# Altium schematic sheet temperature.SchDoc
size A3; Organization: Altium Limited; Address1: L3, 12a Rodborough Rd; Address2: Frenchs Forest; Address3: NSW; Address4: Australia 2086
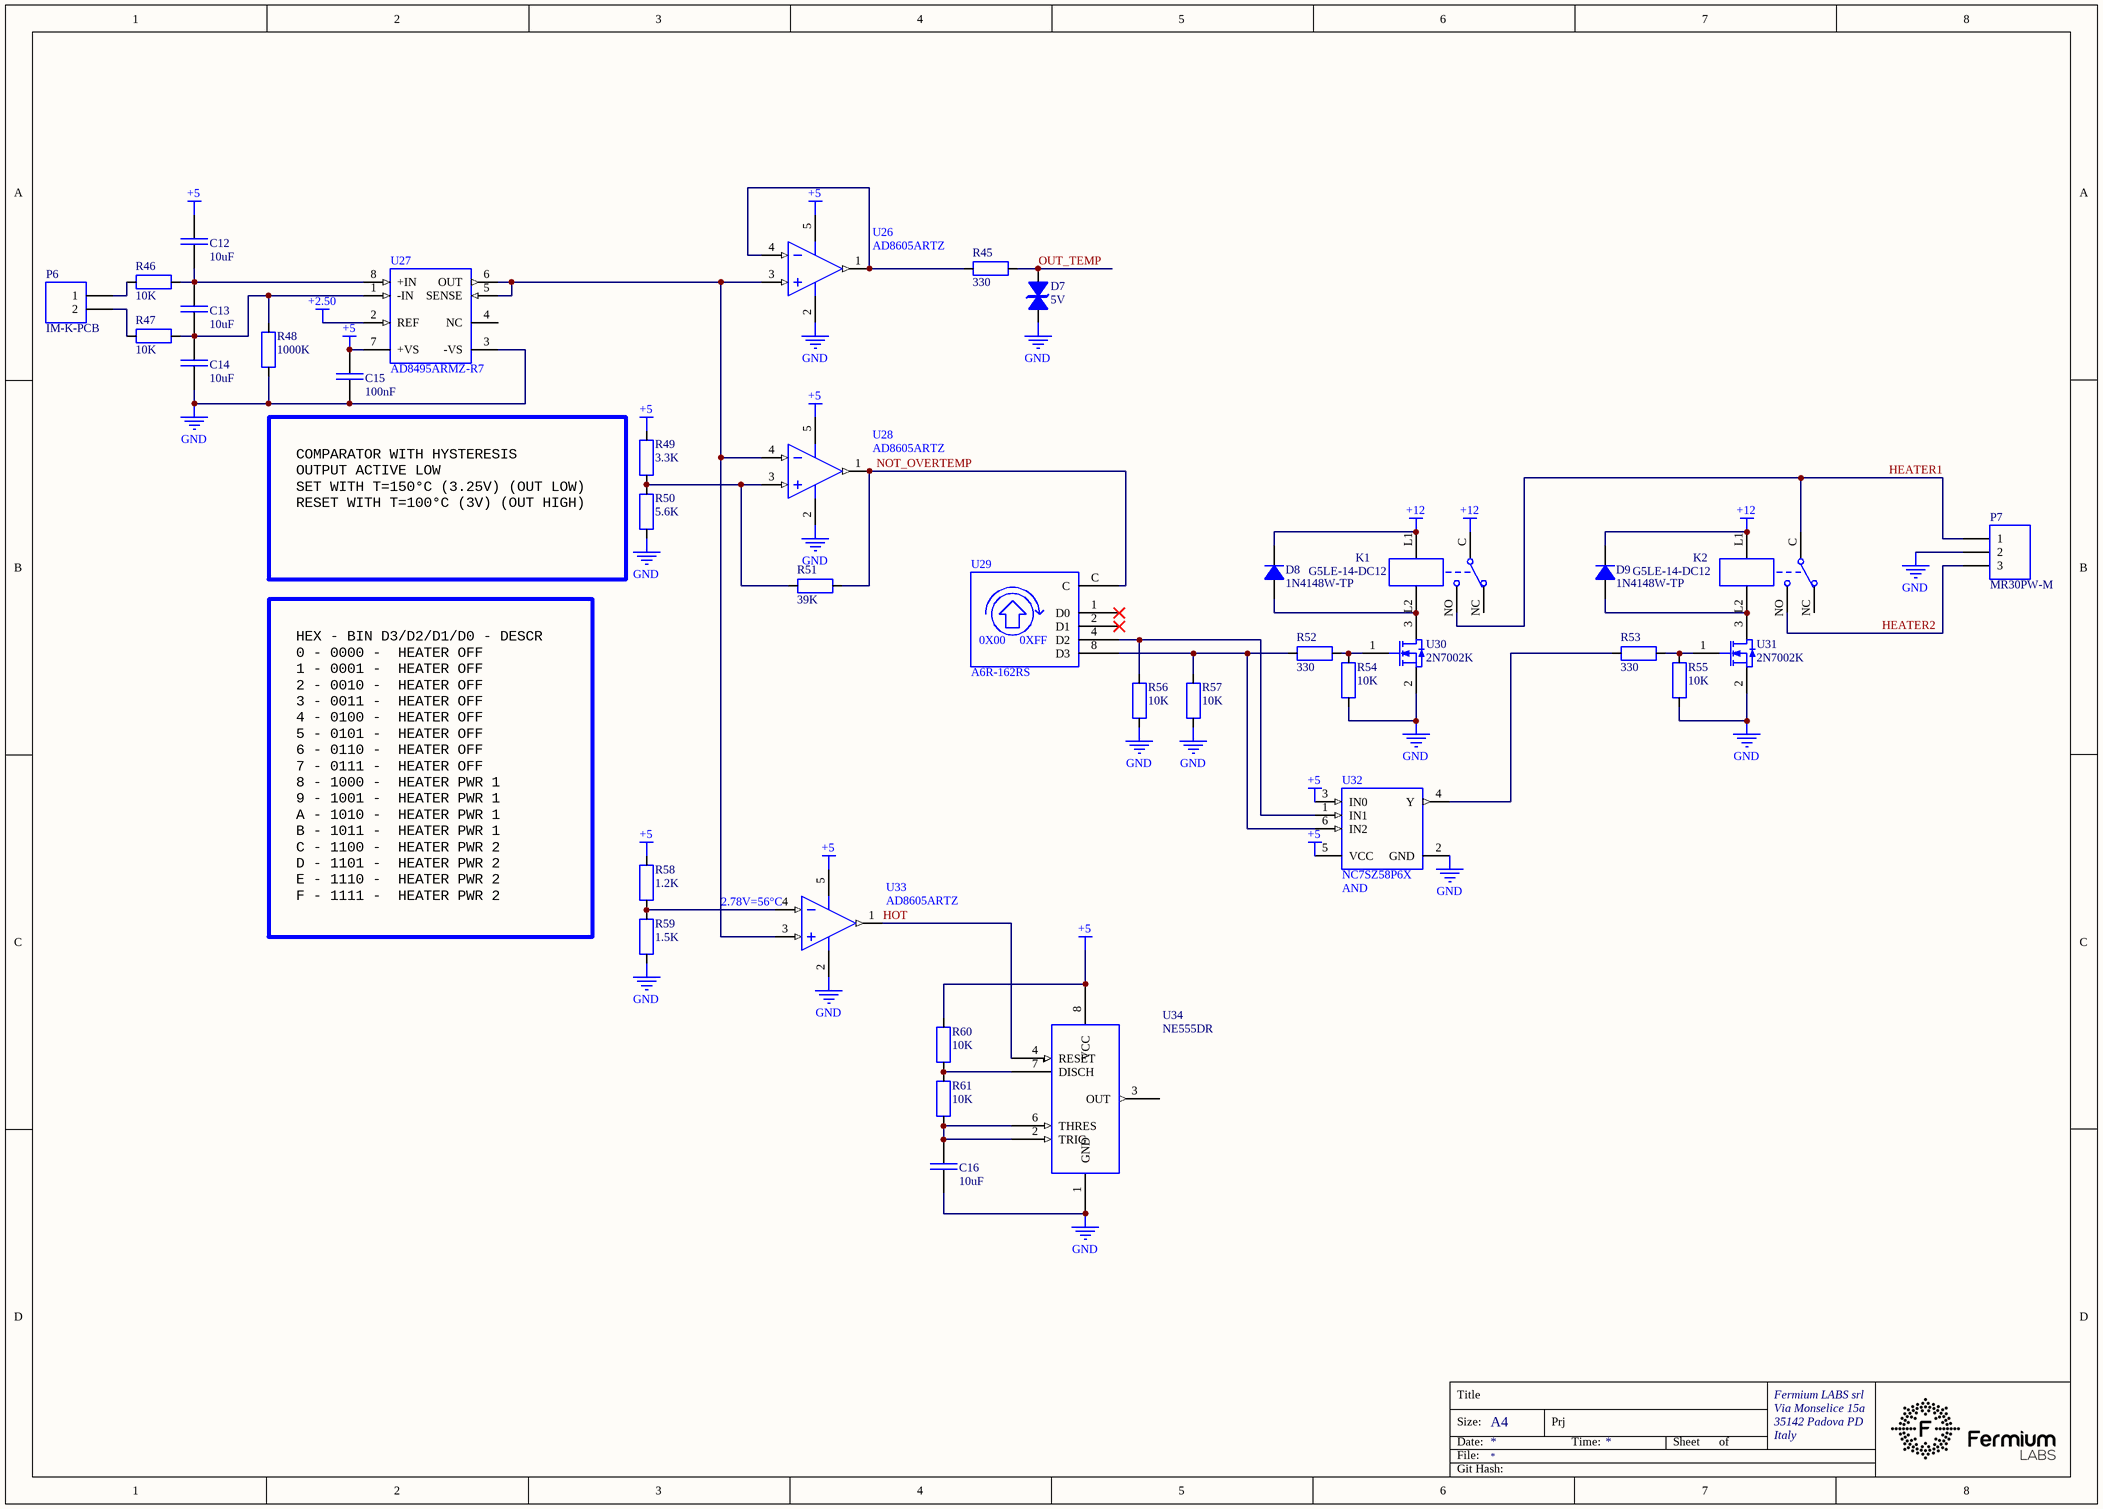
[diagram p0: temperature.SchDoc]

## Parts
C12  10uF  [CAP 0805_2012]
C13  10uF  [CAP 0805_2012]
C14  10uF  [CAP 0805_2012]
C15  100nF  [CAP 0603_1608]
C16  10uF  [CAP 0805_2012]
D7  5V  [SOD523F]
D8  1N4148W-TP  [SOD-123]
D9  1N4148W-TP  [SOD-123]
K1  G5LE-14-DC12  [AAE46D0F-8D2F-4914-8614-C04E242B4758]
K2  G5LE-14-DC12  [AAE46D0F-8D2F-4914-8614-C04E242B4758]
P6  IM-K-PCB  [9044FB30-693E-4780-9B0B-95C5421D70E8]
P7  MR30PW-M  [B3F23392-877C-4EEC-B1AF-B260E8D92153]
R45  330
R46  10K  [RES 0603_1608]
R47  10K  [RES 0603_1608]
R48  1000K
R49  3.3K
R50  5.6K
R51  39K
R52  330
R53  330
R54  10K  [RES 0603_1608]
R55  10K  [RES 0603_1608]
R56  10K  [RES 0603_1608]
R57  10K  [RES 0603_1608]
R58  1.2K
R59  1.5K
R60  10K  [RES 0603_1608]
R61  10K  [RES 0603_1608]
U26  AD8605ARTZ  [A3DDA0BC-073E-4B18-9613-F713A7EC1E27]
U27  AD8495ARMZ-R7  [ANALOG MSOP-8 RM-8]
U28  AD8605ARTZ  [A3DDA0BC-073E-4B18-9613-F713A7EC1E27]
U29  A6R-162RS  [2599C238-5645-4A8C-8BF9-C7515FACCFA0]
U30  2N7002K  [ON SEMI SOT-23-3]
U31  2N7002K  [ON SEMI SOT-23-3]
U32  NC7SZ58P6X  [CF792C6F-51F3-4C59-9918-AD84EFC14FA6]
U33  AD8605ARTZ  [A3DDA0BC-073E-4B18-9613-F713A7EC1E27]
U34  NE555DR  [TI SOIC-8 D]

## Nets
+2.50: U27.2(REF)
+5: C12.2 C15.1 R49.2 R58.2 R60.2 U26.5(+V) U27.7(+VS) U28.5(+V) U32.3(IN0) U32.5(VCC) U33.5(+V) U34.8(VCC)
+12: D8.1(K) D9.1(K) K1.C K1.L1 K2.L1
GND: C14.1 C15.2 C16.1 D7.2 P7.2 R48.1 R50.1 R54.1 R55.1 R56.1 R57.1 R59.1 U26.2(-V) U27.3(-VS) U28.2(-V) U30.2(S) U31.2(S) U32.2(GND) U33.2(-V) U34.1(GND)
HEATER1: K1.NO K2.C P7.1
HEATER2: K2.NO P7.3
HOT: U33.1(OUT) U34.4(RESET)
NOT_OVERTEMP: R51.2 U28.1(OUT) U29.C
OUT_TEMP: D7.1 R45.2
NetC12_1: C12.1 C13.2 R46.1 U27.8(+IN)
NetC13_1: C13.1 C14.2 R47.1 R48.2 U27.1(-IN)
NetC16_2: C16.2 R61.1 U34.2(TRIG) U34.6(THRES)
NetD8_2: D8.2(A) K1.L2 U30.3(D)
NetD9_2: D9.2(A) K2.L2 U31.3(D)
NetP6_1: P6.1 R46.2
NetP6_2: P6.2 R47.2
NetR45_1: R45.1 U26.1(OUT) U26.4(-IN)
NetR49_1: R49.1 R50.2 R51.1 U28.3(+IN)
NetR52_1: R52.1 R57.2 U29.8(D3) U32.6(IN2)
NetR52_2: R52.2 R54.2 U30.1(G)
NetR53_1: R53.1 U32.4(Y)
NetR53_2: R53.2 R55.2 U31.1(G)
NetR56_2: R56.2 U29.4(D2) U32.1(IN1)
NetR58_1: R58.1 R59.2 U33.4(-IN)
NetR60_1: R60.1 R61.2 U34.7(DISCH)
NetU26_3: U26.3(+IN) U27.5(SENSE) U27.6(OUT) U28.4(-IN) U33.3(+IN)

Not connected (* = marked no-connect by the designer): K1 NC; K2 NC; U27 4(NC); U29 1(D0)* 2(D1)*; U34 3(OUT)

## Notes on the sheet
- COMPARATOR WITH HYSTERESIS
  OUTPUT ACTIVE LOW
  SET WITH T=150°C (3.25V) (OUT LOW)
  RESET WITH T=100°C (3V) (OUT HIGH)
- (near U33) 2.78V=56°C
- (near U32) AND
- HEX - BIN D3/D2/D1/D0 - DESCR
  0 - 0000 -  HEATER OFF
  1 - 0001 -  HEATER OFF
  2 - 0010 -  HEATER OFF
  3 - 0011 -  HEATER OFF
  4 - 0100 -  HEATER OFF
  5 - 0101 -  HEATER OFF
  6 - 0110 -  HEATER OFF
  7 - 0111 -  HEATER OFF
  8 - 1000 -  HEATER PWR 1
  9 - 1001 -  HEATER PWR 1
  A - 1010 -  HEATER PWR 1
  B - 1011 -  HEATER PWR 1
  C - 1100 -  HEATER PWR 2
  D - 1101 -  HEATER PWR 2
  E - 1110 -  HEATER PWR 2
  F - 1111 -  HEATER PWR 2
- Title
- Fermium LABS srl
- Size:
- Date:
- File:
- A4
- Prj
- Time:
- Sheet
- of
- Via Monselice 15a
- 35142 Padova PD
- Italy
- Git Hash:
- (in symbol bbf157ad-cd7a-4e82-97e3-d6a037590888) 0X00; 0XFF

## Library data of the parts
C12-C14 C16 = 1ffbe5a9-0884-4740-bdad-20a6a98400e6: CAP SMD MLCC 10uF 25V 0805 X5R; Manufacturer 1: Samsung Electro-Mechanics; Manufacturer Part Number 1: CL21A106KAYNNNE; id: 14779; Part Number: 1ffbe5a9-0884-4740-bdad-20a6a98400e6; ComponentLink1Description: Datasheet; ComponentLink1URL: http://localhost:8080/static/files/Samsung-Electro-Mechanics-CL21A106KAYNNNE_C158502019-03-10_213827.610739.pdf?Samsung-Electro-Mechanics-CL21A106KAYNNNE_C15850.pdf; Manufacturer 2: Murata; Manufacturer Part Number 2: GRM21BR61E106KA73L; Value: 10uF
C15 = 02841f84-ac15-41b5-9e17-915f8f067828: CAP SMD MLCC 100nF 25V 0603 X7R; Manufacturer 1: Samsung Electro-Mechanics; Manufacturer Part Number 1: CL10B104KA8NNNC; id: 14784; Part Number: 02841f84-ac15-41b5-9e17-915f8f067828; ComponentLink1Description: Datasheet; ComponentLink1URL: http://localhost:8080/static/files/Samsung-Electro-Mechanics-CL10B104KA8NNNC_C15902019-03-10_215548.826887.pdf?Samsung-Electro-Mechanics-CL10B104KA8NNNC_C1590.pdf; Value: 100nF
D7 = daa58212-38e2-4326-a156-8e48058c46f1: DIODE SMD TVS 5V BIDIRECTIONAL SOD-523; Manufacturer 1: Born Semiconductor; Manufacturer Part Number 1: PESD5V0S1BBN; id: 14837; Part Number: daa58212-38e2-4326-a156-8e48058c46f1; ComponentLink1Description: Datasheet; ComponentLink1URL: http://localhost:8080/static/files/Nexperia-PESD5V0S1BB-115_C976402019-08-16_201905.624024.pdf?Nexperia-PESD5V0S1BB-115_C97640.pdf; ComponentLink2Description: Datasheet; ComponentLink2URL: http://localhost:8080/static/files/1901051701_Bourne-Semicon-Shenzhen-PESD5V0S1BBN_C3142642019-08-16_201911.992552.pdf?1901051701_Bourne-Semicon-Shenzhen-PESD5V0S1BBN_C314264.pdf; Manufacturer 2: Nexperia; Manufacturer Part Number 2: PESD5V0S1BB,115; Value: 5V
D8 D9 = 5e920700-75df-48e3-84dd-8f9f777caed8: DIODE SMD 100V 150mA 1.5Vf SOD-123 4148; Manufacturer 1: MCC; id: 14795; Part Number: 5e920700-75df-48e3-84dd-8f9f777caed8; ComponentLink1Description: Datasheet; ComponentLink1URL: http://localhost:8080/static/files/Micro-Commercial-Components-MCC-1N4148W-TP_C779782019-04-06_215019.428643.pdf?Micro-Commercial-Components-MCC-1N4148W-TP_C77978.pdf; Manufacturer Part Number 1: 1N4148W-TP
K1 K2 = daf6f3cd-58c4-4886-bcb7-b7b47a76ae08: RELAY SPDT 10A 250VAC 12VDC SUBMINIATURE; Manufacturer 1: Omron; id: 14836; Part Number: daf6f3cd-58c4-4886-bcb7-b7b47a76ae08; ComponentLink1Description: Datasheet; ComponentLink1URL: http://localhost:8080/static/files/Omron-Electronics-G5LE-14-DC12_C116964_12019-08-16_200915.378527.pdf?Omron-Electronics-G5LE-14-DC12_C116964 (1).pdf; Manufacturer Part Number 1: G5LE-14-DC12
P6 = 44088476-53fa-4578-a611-1fd63affe7b4: CONN THERMOCOUPLE K-TYPE THT; Manufacturer 1: Labfacility; id: 14845; Part Number: 44088476-53fa-4578-a611-1fd63affe7b4; ComponentLink1Description: Datasheet; ComponentLink1URL: http://localhost:8080/static/files/28420972019-08-17_162400.037613.pdf?2842097.pdf; Manufacturer Part Number 1: IM-K-PCB
P7 = 8565bfd1-7a71-455a-a363-4ce9dda60de6: CONN DC 3 POLE 15A PCB MALE; Manufacturer 1: Changzhou Amass Elec; id: 14833; Part Number: 8565bfd1-7a71-455a-a363-4ce9dda60de6; ComponentLink1Description: Datasheet; ComponentLink1URL: http://localhost:8080/static/files/MR30PW_SPEC2019-08-16_190138.191607.pdf?MR30PW SPEC.pdf; ComponentLink2Description: 3D Model; ComponentLink2URL: http://localhost:8080/static/files/B3F23392-877C-4EEC-B1AF-B260E8D921532019-08-16_190154.620416.step?B3F23392-877C-4EEC-B1AF-B260E8D92153.step; Manufacturer Part Number 1: MR30PW-M
R45 R52 R53 = e8555d7b-eeda-4727-b2e1-550cdc03d819: RES SMD 330 OHM 1% 1/10W 0603; Manufacturer 1: Yageo; Manufacturer Part Number 1: RC0603FR-07330RL; id: 12350; Part Number: e8555d7b-eeda-4727-b2e1-550cdc03d819; Value: 330
R46 R47 R54-R57 R60 R61 = 93242766-ba1d-462d-b58f-ce1dfc4129c8: RES SMD 10K OHM 1% 1/10W 0603; Manufacturer 1: Yageo; Manufacturer Part Number 1: RC0603FR-0710KL; id: 12101; Part Number: 93242766-ba1d-462d-b58f-ce1dfc4129c8; Value: 10K
R48 = 971a2486-fdc6-42b3-9467-9814f305537f: RES SMD 1000K OHM 1% 1/8W 0805; Manufacturer 1: Yageo; Manufacturer Part Number 1: RC0805FR-071ML; id: 13212; Part Number: 971a2486-fdc6-42b3-9467-9814f305537f; Value: 1000K
R49 = c685e076-af25-4fed-81c8-3eb7c43f01b8: RES SMD 3.3K OHM 1% 1/10W 0603; Manufacturer 1: Yageo; Manufacturer Part Number 1: RC0603FR-073K3L; id: 12615; Part Number: c685e076-af25-4fed-81c8-3eb7c43f01b8; Value: 3.3K
R50 = afc45e5f-a770-4ee7-b734-99356076b47f: RES SMD 5.6K OHM 1% 1/10W 0603; Manufacturer 1: Yageo; Manufacturer Part Number 1: RC0603FR-075K6L; id: 12513; Part Number: afc45e5f-a770-4ee7-b734-99356076b47f; Value: 5.6K
R51 = 10a824dc-98f1-41df-91f2-219e0508d035: RES SMD 39K OHM 1% 1/10W 0603; Manufacturer 1: Yageo; Manufacturer Part Number 1: RC0603FR-0739KL; id: 12426; Part Number: 10a824dc-98f1-41df-91f2-219e0508d035; Value: 39K
R58 = 2f6201d5-48c6-41ab-ab40-2cc6255291b8: RES SMD 1.2K OHM 1% 1/10W 0603; Manufacturer 1: Yageo; Manufacturer Part Number 1: RC0603FR-071K2L; id: 12078; Part Number: 2f6201d5-48c6-41ab-ab40-2cc6255291b8; Value: 1.2K
R59 = d098bc01-c90d-4b51-91ee-1d9d1ccd8970: RES SMD 1.5K OHM 1% 1/10W 0603; Manufacturer 1: Yageo; Manufacturer Part Number 1: RC0603FR-071K5L; id: 12166; Part Number: d098bc01-c90d-4b51-91ee-1d9d1ccd8970; Value: 1.5K
U26 U28 U33 = 5610e9ea-bca8-49b2-8e5f-11409231f6a4: IC OPAMP 65uV 1pA RRIO 5V 80mA SOT-23-5; Manufacturer 1: Analog Devices; id: 14830; Part Number: 5610e9ea-bca8-49b2-8e5f-11409231f6a4; ComponentLink1Description: Datasheet; ComponentLink1URL: http://localhost:8080/static/files/Analog_Devices-AD8605ARTZ-REEL7-datasheet2019-08-16_175825.352099.pdf?Analog_Devices-AD8605ARTZ-REEL7-datasheet.pdf; Manufacturer Part Number 1: AD8605ARTZ
U27 = 8cc7f909-42c7-4251-909a-43740f41a1ca: IC THERMOCOUPLE AMPLIFIER MSOP-8; Manufacturer 1: Analog Devices; id: 14832; Part Number: 8cc7f909-42c7-4251-909a-43740f41a1ca; ComponentLink1Description: Datasheet; ComponentLink1URL: http://localhost:8080/static/files/Analog-Devices-ADI-AD8495ARMZ-R7_C596582019-08-16_182304.166986.pdf?Analog-Devices-ADI-AD8495ARMZ-R7_C59658.pdf; Manufacturer Part Number 1: AD8495ARMZ-R7
U29 = bbf157ad-cd7a-4e82-97e3-d6a037590888: SWITCH ROTARY HEX/BCD 16 POSITIONS; Manufacturer 1: Omron; id: 14834; Part Number: bbf157ad-cd7a-4e82-97e3-d6a037590888; ComponentLink1Description: Datasheet; ComponentLink1URL: http://localhost:8080/static/files/A6R-A6RV2019-08-16_190638.241287.PDF?A6R-A6RV.PDF; ComponentLink2Description: 3D Model; ComponentLink2URL: http://localhost:8080/static/files/2599C238-5645-4A8C-8BF9-C7515FACCFA02019-08-16_192704.487115.step?2599C238-5645-4A8C-8BF9-C7515FACCFA0.step; Manufacturer Part Number 1: A6R-162RS
U30 U31 = 3a318f0a-3b94-47d9-91d5-8fc0a2f410e8: MOSFET N-CHANNEL LOGIC LEVEL 300mA 3ohm 60V ESD-PROT 2N7002K SOT-23; Manufacturer 1: ON Semiconductor; Manufacturer Part Number 1: 2N7002KT1G; id: 14846; Part Number: 3a318f0a-3b94-47d9-91d5-8fc0a2f410e8; ComponentLink1Description: Datasheet; ComponentLink1URL: http://localhost:8080/static/files/ON-Semicon-ON-2N7002KT1G_C1165842019-08-17_164859.682835.pdf?ON-Semicon-ON-2N7002KT1G_C116584.pdf; ComponentLink2Description: Datasheet; ComponentLink2URL: http://localhost:8080/static/files/Vishay-Intertech-2N7002K-T1-GE3_C814452019-08-17_164907.199439.pdf?Vishay-Intertech-2N7002K-T1-GE3_C81445.pdf; ComponentLink3Description: Datasheet; ComponentLink3URL: http://localhost:8080/static/files/DATA; Manufacturer 2: Vishay; Manufacturer 3: Diodes Inc.; Manufacturer Part Number 2: 2N7002K-T1-GE3; Manufacturer Part Number 3: 2N7002K-7
U32 = 22da43c7-1950-42f4-bc93-10d9cca79b4d: IC LOGIC PORT CONFIGURABLE AND, OR, NAND, NOR, XOR, BUFFER, NOT 8ns  74XX58 SC-70; Manufacturer 1: ON Semiconductor; id: 14841; Part Number: 22da43c7-1950-42f4-bc93-10d9cca79b4d; ComponentLink1Description: Datasheet; ComponentLink1URL: http://localhost:8080/static/files/1812220431_ON-Semicon-ON-NC7SZ58P6X_C2328042019-08-17_005741.293796.pdf?1812220431_ON-Semicon-ON-NC7SZ58P6X_C232804.pdf; ComponentLink2Description: Datasheet; ComponentLink2URL: http://localhost:8080/static/files/Texas-Instruments-TI-SN74LVC1G58DCKR_C78422019-08-17_005749.189474.pdf?Texas-Instruments-TI-SN74LVC1G58DCKR_C7842.pdf; Manufacturer 2: Texas Instruments; Manufacturer Part Number 1: NC7SZ58P6X; Manufacturer Part Number 2: SN74LVC1G58DCKR
U34 = d16ab88a-2543-469a-8940-7b800b633548: IC SMD TIMER NE555 SOIC-8; Manufacturer 1: Texas Instruments; id: 14787; Part Number: d16ab88a-2543-469a-8940-7b800b633548; ComponentLink1Description: Datasheet; ComponentLink1URL: http://localhost:8080/static/files/Texas-Instruments-TI-NE555DR_C7593_22019-03-10_221020.033506.pdf?Texas-Instruments-TI-NE555DR_C7593 (2).pdf; Manufacturer Part Number 1: NE555DR